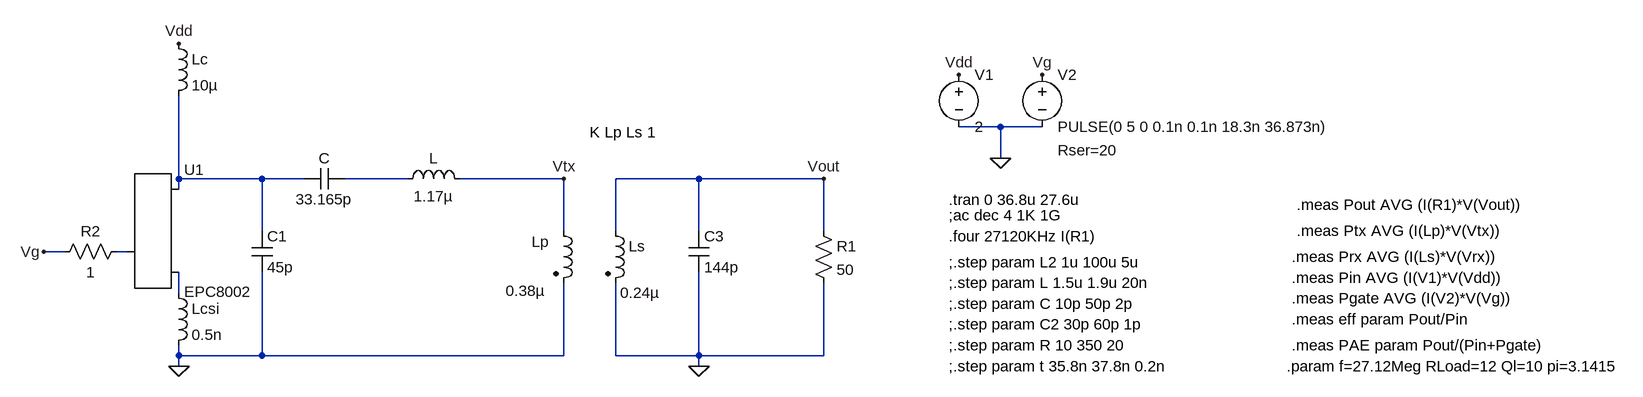
[diagram p0: schematic ClassE_Coil.asc]
ClassE_Coil.asc, the LTspice schematic file:
Version 4
SHEET 1 1352 680
WIRE 176 -80 112 -80
WIRE 240 -80 176 -80
WIRE 176 -32 176 -80
WIRE -1088 0 -1088 -128
WIRE -960 0 -1088 0
WIRE -896 0 -960 0
WIRE -736 0 -832 0
WIRE -496 0 -656 0
WIRE -288 0 -416 0
WIRE -96 0 -288 0
WIRE -1088 16 -1088 0
WIRE -960 80 -960 0
WIRE -496 80 -496 0
WIRE -416 80 -416 0
WIRE -288 80 -288 0
WIRE -96 80 -96 0
WIRE -1264 112 -1296 112
WIRE -1168 112 -1184 112
WIRE -1088 176 -1088 144
WIRE -1088 272 -1088 256
WIRE -960 272 -960 144
WIRE -960 272 -1088 272
WIRE -496 272 -496 160
WIRE -496 272 -960 272
WIRE -416 272 -416 160
WIRE -288 272 -288 144
WIRE -288 272 -416 272
WIRE -96 272 -96 160
WIRE -96 272 -288 272
WIRE -1088 288 -1088 272
WIRE -288 288 -288 272
FLAG -1088 -208 Vdd
FLAG -1296 112 Vg
FLAG 176 -32 0
FLAG 112 -160 Vdd
FLAG 240 -160 Vg
FLAG -496 0 Vtx
FLAG -1088 288 0
FLAG -288 288 0
FLAG -96 0 Vout
SYMBOL EPCGaN -1168 112 R0
SYMATTR InstName U1
SYMATTR Value EPC8002
SYMBOL ind -1104 -224 R0
SYMATTR InstName Lc
SYMATTR Value 10µ
SYMATTR SpiceLine Rser=0.1
SYMBOL ind -752 16 R270
WINDOW 0 32 56 VTop 2
WINDOW 3 5 56 VBottom 2
SYMATTR InstName L
SYMATTR Value 1.17µ
SYMATTR SpiceLine Rser=0.1
SYMBOL cap -832 -16 R90
WINDOW 0 0 32 VBottom 2
WINDOW 3 32 32 VTop 2
SYMATTR InstName C
SYMATTR Value 33.165p
SYMATTR SpiceLine Rser=0.1
SYMBOL res -112 64 R0
SYMATTR InstName R1
SYMATTR Value 50
SYMBOL voltage 112 -176 R0
WINDOW 123 0 0 Left 0
WINDOW 39 0 0 Left 0
SYMATTR InstName V1
SYMATTR Value 2
SYMBOL voltage 240 -176 R0
WINDOW 39 24 132 Left 2
SYMATTR SpiceLine Rser=20
SYMATTR InstName V2
SYMATTR Value PULSE(0 5 0 0.1n 0.1n 18.3n 36.873n)
SYMBOL cap -976 80 R0
SYMATTR InstName C1
SYMATTR Value 45p
SYMATTR SpiceLine Rser=0.1
SYMBOL res -1168 96 R90
WINDOW 0 0 56 VBottom 2
WINDOW 3 32 56 VTop 2
SYMATTR InstName R2
SYMATTR Value 1
SYMBOL ind2 -512 64 R0
WINDOW 0 -33 33 Left 2
WINDOW 3 -73 108 Left 2
SYMATTR InstName Lp
SYMATTR Value 0.38µ
SYMATTR Type ind
SYMATTR SpiceLine Rser=20
SYMBOL ind2 -432 64 R0
WINDOW 3 23 111 Left 2
SYMATTR Value 0.24µ
SYMATTR InstName Ls
SYMATTR Type ind
SYMATTR SpiceLine Rser=0.28 Cpar=1.26p
SYMBOL cap -304 80 R0
SYMATTR InstName C3
SYMATTR Value 144p
SYMBOL ind -1104 160 R0
SYMATTR InstName Lcsi
SYMATTR Value 0.5n
SYMATTR SpiceLine Rser=0.1
TEXT 96 32 Left 2 !.tran 0 36.8u 27.6u
TEXT 96 56 Left 2 !;ac dec 4 1K 1G
TEXT 96 160 Left 2 !;.step param L 1.5u 1.9u 20n
TEXT 632 40 Left 2 !.meas Pout AVG (I(R1)*V(Vout))
TEXT 624 152 Left 2 !.meas Pin AVG (I(V1)*V(Vdd))
TEXT 624 216 Left 2 !.meas eff param Pout/Pin
TEXT 96 88 Left 2 !.four 27120KHz I(R1)
TEXT 96 256 Left 2 !;.step param R 10 350 20
TEXT 96 128 Left 2 !;.step param L2 1u 100u 5u
TEXT 96 192 Left 2 !;.step param C 10p 50p 2p
TEXT 96 224 Left 2 !;.step param C2 30p 60p 1p
TEXT 96 288 Left 2 !;.step param t 35.8n 37.8n 0.2n
TEXT 616 288 Left 2 !.param f=27.12Meg RLoad=12 Ql=10 pi=3.1415
TEXT 624 184 Left 2 !.meas Pgate AVG (I(V2)*V(Vg))
TEXT 624 256 Left 2 !.meas PAE param Pout/(Pin+Pgate)
TEXT -456 -72 Left 2 !K Lp Ls 1
TEXT 632 80 Left 2 !.meas Ptx AVG (I(Lp)*V(Vtx))
TEXT 624 120 Left 2 !.meas Prx AVG (I(Ls)*V(Vrx))

The netlist it stands for:
* ClassE_Coil.asc
XU1 N003 N001 N004 EPC8002
Lc Vdd N001 10µ Rser=0.1
L N002 Vtx 1.17µ Rser=0.1
C N002 N001 33.165p Rser=0.1
R1 Vout 0 50
V1 Vdd 0 2
V2 Vg 0 PULSE(0 5 0 0.1n 0.1n 18.3n 36.873n) Rser=20
C1 N001 0 45p Rser=0.1
R2 N003 Vg 1
Lp Vtx 0 0.38µ Rser=20
Ls Vout 0 0.24µ Rser=0.28 Cpar=1.26p
C3 Vout 0 144p
Lcsi N004 0 0.5n Rser=0.1
.tran 0 36.8u 27.6u
;ac dec 4 1K 1G
;.step param L 1.5u 1.9u 20n
.meas Pout AVG (I(R1)*V(Vout))
.meas Pin AVG (I(V1)*V(Vdd))
.meas eff param Pout/Pin
.four 27120KHz I(R1)
;.step param R 10 350 20
;.step param L2 1u 100u 5u
;.step param C 10p 50p 2p
;.step param C2 30p 60p 1p
;.step param t 35.8n 37.8n 0.2n
.param f=27.12Meg RLoad=12 Ql=10 pi=3.1415
.meas Pgate AVG (I(V2)*V(Vg))
.meas PAE param Pout/(Pin+Pgate)
K Lp Ls 1
.meas Ptx AVG (I(Lp)*V(Vtx))
.meas Prx AVG (I(Ls)*V(Vrx))
.backanno
.end